# EAGLE schematic TubeBoard (EAGLE 9.3.0)
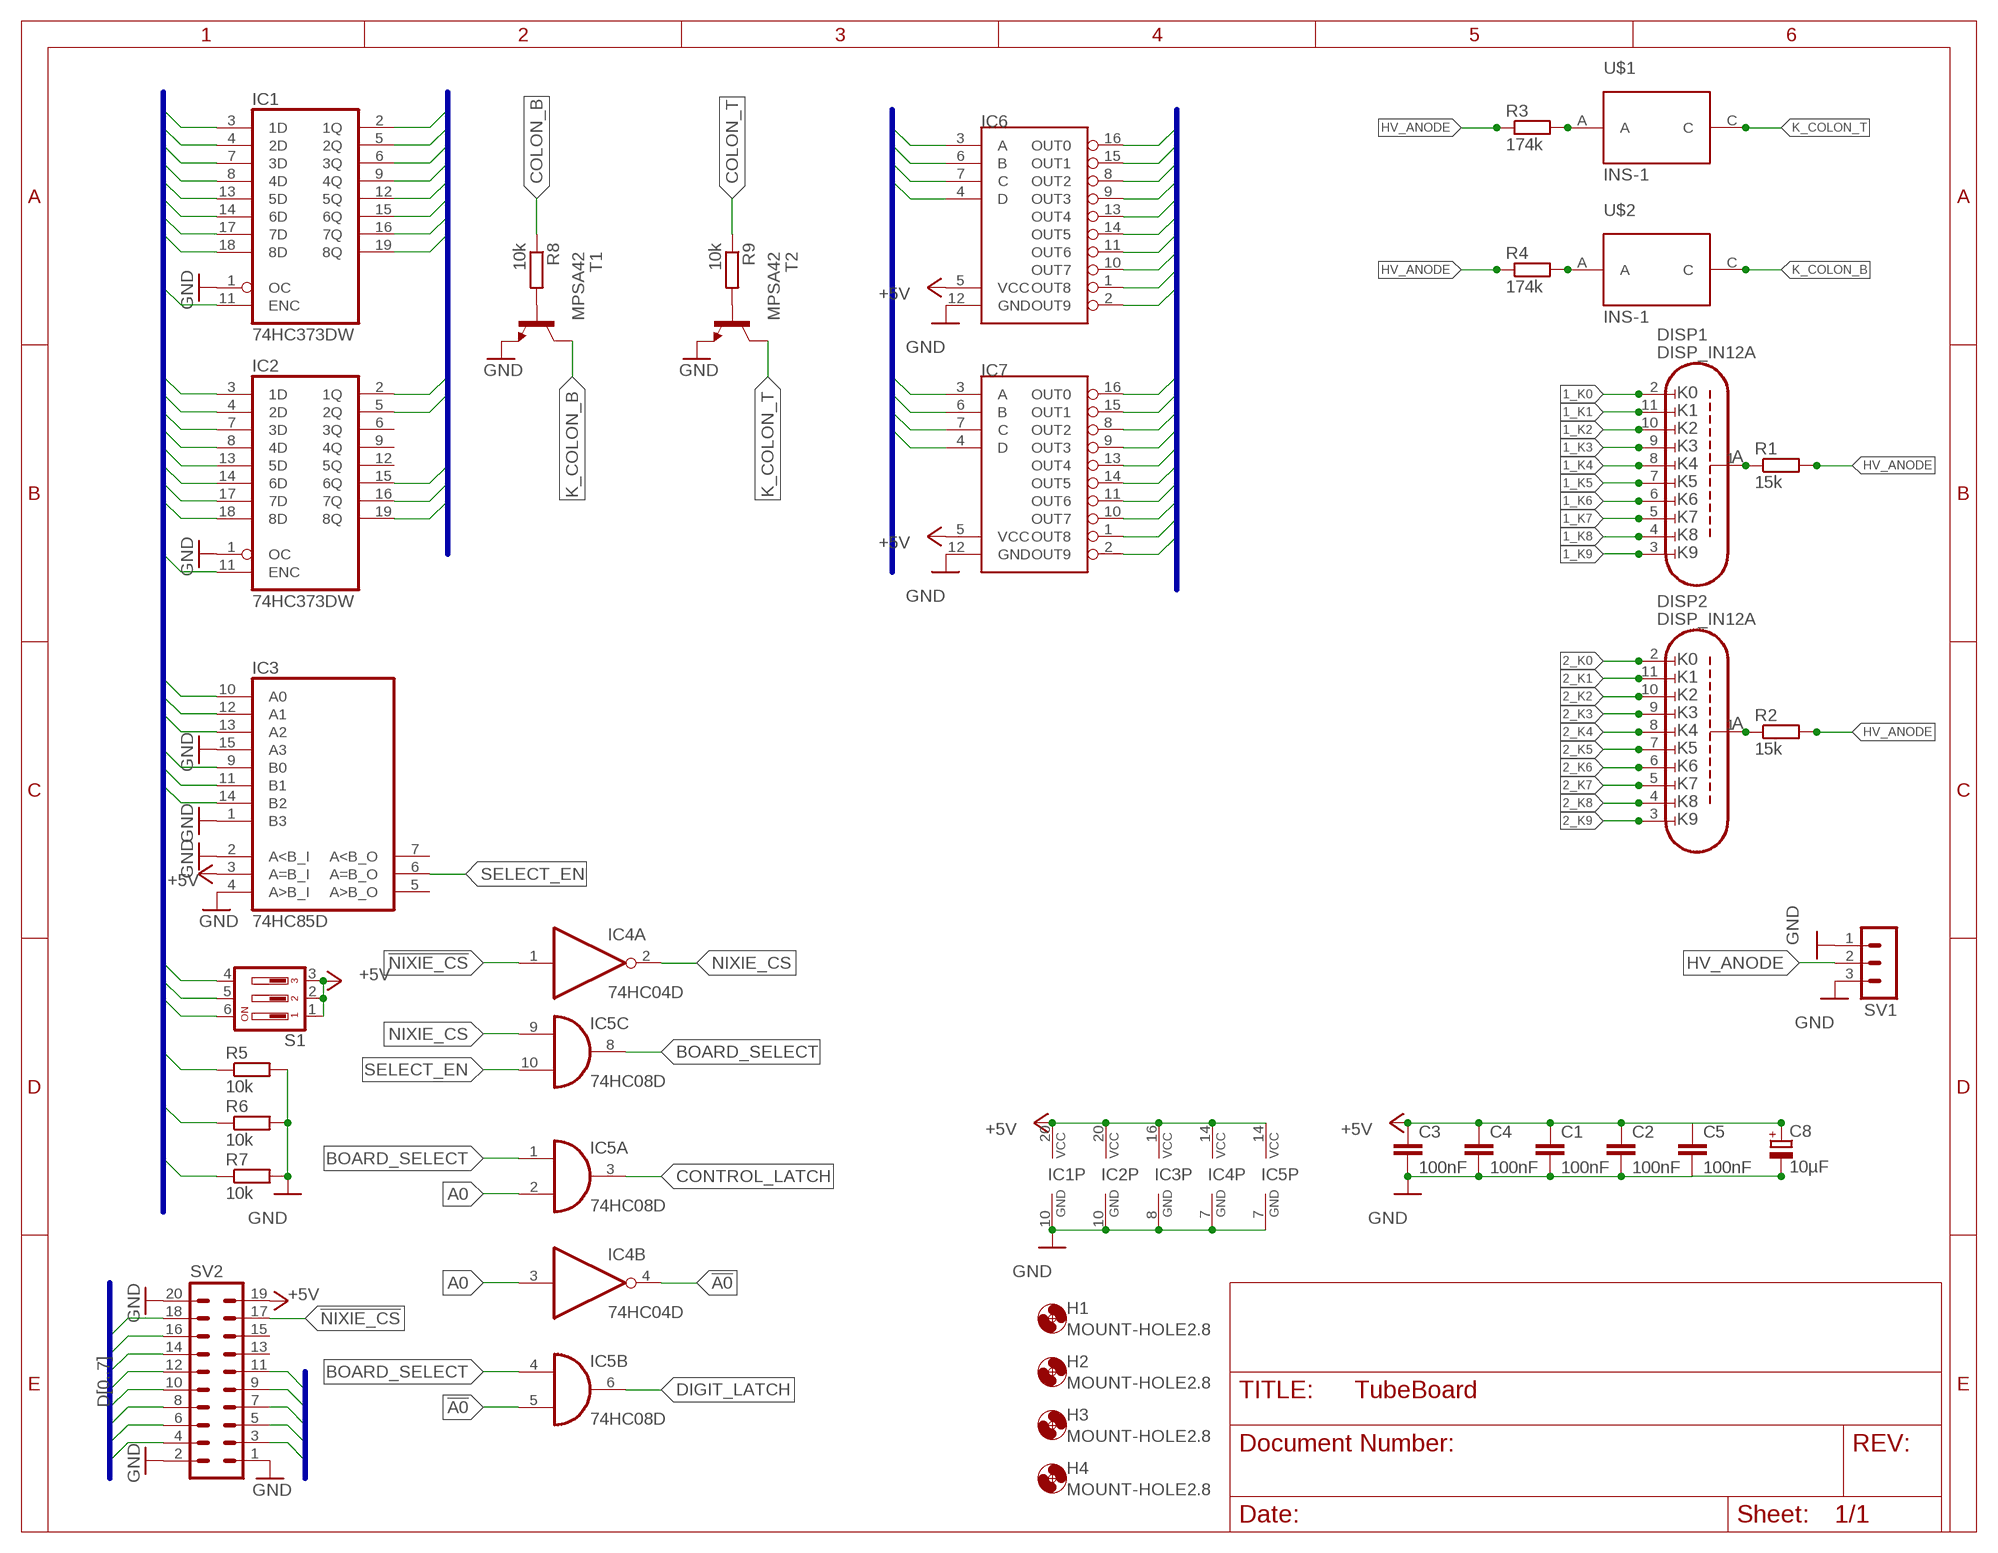
[diagram p0: schematic, sheet 1]

## Parts
C1  100nF  C-EUC1206  [C1206]
C2  100nF  C-EUC1206  [C1206]
C3  100nF  C-EUC1206  [C1206]
C4  100nF  C-EUC1206  [C1206]
C5  100nF  C-EUC1206  [C1206]
C8  10µF  CPOL-EUSMCB  [SMC_B]
DISP1  DISP_IN12A  [DISP_IN-12_SOCKET]
DISP2  DISP_IN12A  [DISP_IN-12_SOCKET]
H1  MOUNT-HOLE2.8  [2,8]
H2  MOUNT-HOLE2.8  [2,8]
H3  MOUNT-HOLE2.8  [2,8]
H4  MOUNT-HOLE2.8  [2,8]
IC1  74HC373DW  [SO20W]
IC2  74HC373DW  [SO20W]
IC3  74HC85D  [SO16]
IC4  74HC04D  [SO14]
IC5  74HC08D  [SO14]
IC6  7441DIL16  [DIL16]
IC7  7441DIL16  [DIL16]
R1  15k  R-EU_0411/12  [0411/12]
R2  15k  R-EU_0411/12  [0411/12]
R3  174k  R-EU_M1206  [M1206]
R4  174k  R-EU_M1206  [M1206]
R5  10k  R-EU_R2012  [R2012]
R6  10k  R-EU_R2012  [R2012]
R7  10k  R-EU_R2012  [R2012]
R8  10k  R-EU_R2012  [R2012]
R9  10k  R-EU_R2012  [R2012]
S1  SD4-03  [SD4-03]
SV1  MA03-1  [MA03-1]
SV2  MA10-2  [MA10-2]
T1  MPSA42  MPSA42-NPN-TO92-EBC  [TO92-EBC]
T2  MPSA42  MPSA42-NPN-TO92-EBC  [TO92-EBC]
U$1  INS-1  [INS-1]
U$2  INS-1  [INS-1]

## Nets
1_K0: DISP1.2(K0) IC6.16(OUT0)
1_K1: DISP1.11(K1) IC6.15(OUT1)
1_K2: DISP1.10(K2) IC6.8(OUT2)
1_K3: DISP1.9(K3) IC6.9(OUT3)
1_K4: DISP1.8(K4) IC6.13(OUT4)
1_K5: DISP1.7(K5) IC6.14(OUT5)
1_K6: DISP1.6(K6) IC6.11(OUT6)
1_K7: DISP1.5(K7) IC6.10(OUT7)
1_K8: DISP1.4(K8) IC6.1(OUT8)
1_K9: DISP1.3(K9) IC6.2(OUT9)
2_K0: DISP2.2(K0) IC7.16(OUT0)
2_K1: DISP2.11(K1) IC7.15(OUT1)
2_K2: DISP2.10(K2) IC7.8(OUT2)
2_K3: DISP2.9(K3) IC7.9(OUT3)
2_K4: DISP2.8(K4) IC7.13(OUT4)
2_K5: DISP2.7(K5) IC7.14(OUT5)
2_K6: DISP2.6(K6) IC7.11(OUT6)
2_K7: DISP2.5(K7) IC7.10(OUT7)
2_K8: DISP2.4(K8) IC7.1(OUT8)
2_K9: DISP2.3(K9) IC7.2(OUT9)
!A0: IC4.4(B:O) IC5.5(B:I1)
!NIXIE_CS: IC4.1(A:I) SV2.17
+5V: C1.1 C2.1 C3.1 C4.1 C5.1 C8.+ IC1.20(VCC) IC2.20(VCC) IC3.3(A=B_I) IC3.16(VCC) IC4.14(P:VCC) IC5.14(P:VCC) IC6.5(VCC) IC7.5(VCC) S1.1 S1.2 S1.3 SV2.19
A0: IC4.3(B:I) IC5.2(A:I1) SV2.3
A1: SV2.5
A2: IC3.10(A0) SV2.7
A3: IC3.12(A1) SV2.9
A4: IC3.13(A2) SV2.11
BOARD_SELECT: IC5.1(A:I0) IC5.4(B:I0) IC5.8(C:O)
COLON_B: IC2.2(1Q) R8.1
COLON_T: IC2.5(2Q) R9.1
CONTROL_LATCH: IC2.11(ENC) IC5.3(A:O)
D0: IC1.3(1D) IC2.3(1D) SV2.8
D1: IC1.4(2D) IC2.4(2D) SV2.6
D2: IC1.7(3D) IC2.7(3D) SV2.4
D3: IC1.8(4D) IC2.8(4D) SV2.10
D4: IC1.13(5D) IC2.13(5D) SV2.12
D5: IC1.14(6D) IC2.14(6D) SV2.14
D6: IC1.17(7D) IC2.17(7D) SV2.16
D7: IC1.18(8D) IC2.18(8D) SV2.18
DIGIT_LATCH: IC1.11(ENC) IC5.6(B:O)
DRIVE_HI: IC2.19(8Q)
DRIVE_LO: IC2.15(6Q)
DRIVE_MED: IC2.16(7Q)
GND: C1.2 C2.2 C3.2 C4.2 C5.2 C8.- IC1.1(OC) IC1.10(GND) IC2.1(OC) IC2.10(GND) IC3.1(B3) IC3.2(A<B_I) IC3.4(A>B_I) IC3.8(GND) IC3.15(A3) IC4.7(P:GND) IC5.7(P:GND) IC6.12(GND) IC7.12(GND) R5.2 R6.2 R7.2 SV1.1 SV1.3 SV2.1 SV2.2 SV2.20 T1.E T2.E
HV_ANODE: R1.2 R2.2 R3.1 R4.1 SV1.2
ID0: IC3.9(B0) R7.1 S1.6
ID1: IC3.11(B1) R6.1 S1.5
ID2: IC3.14(B2) R5.1 S1.4
K_COLON_B: T1.C U$2.C
K_COLON_T: T2.C U$1.C
LDIGIT0: IC1.2(1Q) IC6.3(A)
LDIGIT1: IC1.5(2Q) IC6.6(B)
LDIGIT2: IC1.6(3Q) IC6.7(C)
LDIGIT3: IC1.9(4Q) IC6.4(D)
N$1: DISP1.1(ANODE) R1.1
N$2: DISP2.1(ANODE) R2.1
N$3: R3.2 U$1.A
N$4: R4.2 U$2.A
N$5: R8.2 T1.B
N$6: R9.2 T2.B
NIXIE_CS: IC4.2(A:O) IC5.9(C:I0)
RDIGIT0: IC1.12(5Q) IC7.3(A)
RDIGIT1: IC1.15(6Q) IC7.6(B)
RDIGIT2: IC1.16(7Q) IC7.7(C)
RDIGIT3: IC1.19(8Q) IC7.4(D)
SELECT_EN: IC3.6(A=B_O) IC5.10(C:I1)
Unconnected: IC2.6(3Q) IC2.9(4Q) IC2.12(5Q) IC3.5(A>B_O) IC3.7(A<B_O) IC4.5(C:I) IC4.6(C:O) IC4.8(D:O) IC4.9(D:I) IC4.10(E:O) IC4.11(E:I) IC4.12(F:O) IC4.13(F:I) IC5.11(D:O) IC5.12(D:I0) IC5.13(D:I1) SV2.13 SV2.15

## Buses
D[0..7]
A[0..19]
A[0..4],CONTROL_LATCH,D[0..7],DIGIT_LATCH,ID[0..2]
LDIGIT[0..3],RDIGIT[0..3]
1_K[0..9],2_K[0..9]
COLON_B,COLON_T,DRIVE_HI,DRIVE_LO,DRIVE_MED,LDIGIT[0..3],RDIGIT[0..3]

## Library data of the parts
C1-C5 = rcl:C-EU: CAPACITOR, European symbol; SPICEPREFIX: C
C8 = rcl:CPOL-EU: POLARIZED CAPACITOR, European symbol; MOUSER: 581-TAJB106K020RNJV; SPICEPREFIX: C
DISP1 DISP2 = dp_devices:DISP_IN12A: IN-12A Nixie Display
H1-H4 = holes:MOUNT-HOLE: MOUNTING HOLE with drill center marker
IC1 IC2 = 74xx-eu:74*373: Octal D type transparent LATCH, edge triggered
IC3 = 74xx-eu:74*85: 4-bit magnitude COMPARATOR; MOUSER: 771-74HC85D-T
IC4 = 74xx-eu:74*04: Hex INVERTER
IC5 = 74xx-eu:74*08: Quad 2-input AND gate
IC6 IC7 = Parts:7441: 7441 Nixie Driver Compatible with K155ID1 (Russian clone). Datasheet <https://tubehobby.com/datasheets/k155id1.pdf>
R1 R2 = rcl:R-EU_: RESISTOR, European symbol; MOUER: 588-OM1535E-R58; SPICEPREFIX: R
R3 R4 = rcl:R-EU_: RESISTOR, European symbol; MOUSER: 667-ERJ-8ENF1743V; SPICEPREFIX: R
R5-R9 = rcl:R-EU_: RESISTOR, European symbol; MOUSER: 652-CR0805FX-1002ELF; SPICEPREFIX: R
S1 = switch-dil:SD4-03: DIL/CODE SWITCH; MOUSER: 611-BDB03; OC_FARNELL: unknown; OC_NEWARK: unknown
SV1 = con-lstb:MA03-1: PIN HEADER; OC_FARNELL: unknown; OC_NEWARK: unknown
SV2 = con-lstb:MA10-2: PIN HEADER; OC_FARNELL: unknown; OC_NEWARK: unknown
T1 T2 = transistor:*-NPN-: NPN Transistror BF959 corrected 2008.03.06; MOUSER: 833-MPSA42-AP
U$1 U$2 = Parts:INS-1

## Net classes
0 default: width 0.203 mm